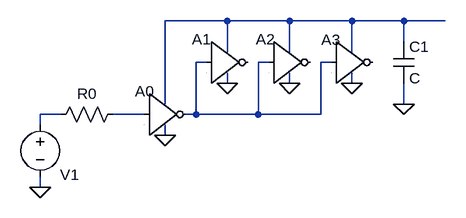
[diagram p0: schematic invSokutei.asc]
invSokutei.asc, the LTspice schematic file:
Version 4
SHEET 1 880 680
WIRE 256 16 160 16
WIRE 352 16 256 16
WIRE 448 16 352 16
WIRE 528 16 448 16
WIRE 592 16 528 16
WIRE 528 48 528 16
WIRE 256 64 256 16
WIRE 352 64 352 16
WIRE 448 64 448 16
WIRE 224 80 208 80
WIRE 320 80 304 80
WIRE 416 80 400 80
WIRE 256 112 256 96
WIRE 352 112 352 96
WIRE 448 112 448 96
WIRE 160 144 160 16
WIRE 528 144 528 112
WIRE 0 160 -32 160
WIRE 128 160 80 160
WIRE 208 160 208 80
WIRE 208 160 192 160
WIRE 304 160 304 80
WIRE 304 160 208 160
WIRE 400 160 400 80
WIRE 400 160 304 160
WIRE -32 176 -32 160
WIRE 160 192 160 176
WIRE -32 272 -32 256
FLAG 256 112 0
FLAG 352 112 0
FLAG 448 112 0
FLAG -32 272 0
FLAG 528 144 0
FLAG 160 192 0
SYMBOL Digital\\inv 224 16 R0
WINDOW 0 -22 28 Left 2
SYMATTR InstName A1
SYMBOL Digital\\inv 320 16 R0
WINDOW 0 -20 28 Left 2
SYMATTR InstName A2
SYMBOL Digital\\inv 416 16 R0
WINDOW 0 -15 29 Left 2
SYMATTR InstName A3
SYMBOL Digital\\inv 128 96 R0
WINDOW 0 -14 28 Left 2
SYMATTR InstName A0
SYMBOL res 96 144 R90
WINDOW 0 0 56 VBottom 2
WINDOW 3 32 56 VTop 2
SYMATTR InstName R0
SYMATTR Value ""
SYMBOL voltage -32 160 R0
WINDOW 0 31 93 Left 2
SYMATTR InstName V1
SYMATTR Value ""
SYMBOL cap 512 48 R0
SYMATTR InstName C1

The netlist it stands for:
* invSokutei.asc
A1 N002 0 0 0 0 0 0 0 BUF
A2 N002 0 0 0 0 0 0 0 BUF
A3 N002 0 0 0 0 0 0 0 BUF
A0 N004 0 0 0 0 N002 0 0 BUF
R0 N004 N003
V1 N003 0
C1 N001 0 C
.backanno
.end